# Altium schematic sheet Power.SchDoc: Power
size A3; DocumentNumber: Power; Revision: 2.0; SheetNumber: 6; SheetTotal: 7; Engineer: Dim Su; ContentRev1: Original Document; dateREV1: "Aug/31/2018"; dateREV2: "Sep/03/2018"; ContentRev2: Corrections to PSU IC; Rev1: V1; Rev2: V2; Project: LED_MAT_3
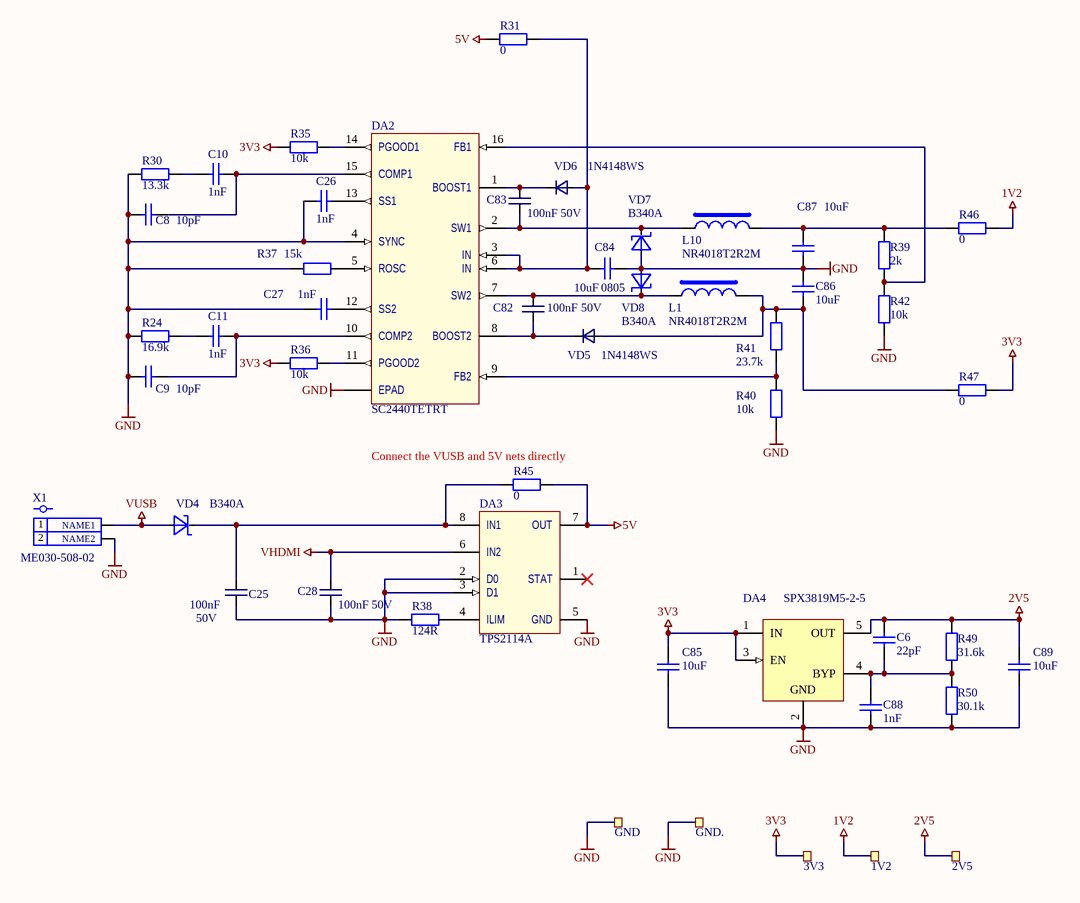
[diagram p0: Power.SchDoc]

## Parts
1V2  TP_TH  [TP_TH_1MM]  (value not drawn)  (no BOM)
2V5  Ø1.0mm,SMD  [TP_SMD_1MM]  (value not drawn)  (no BOM)
3V3  TP_TH  [TP_TH_1MM]  (value not drawn)  (no BOM)
C6  value 22pF  [CAPC1608L]  (hidden comment: 22pF / 0603 / COG / 50V)
C8  value 10pF  [CAPC1608L]  (hidden comment: 10pF / 0603 / COG / 50V)
C9  value 10pF  [CAPC1608L]  (hidden comment: 10pF / 0603 / COG / 50V)
C10  value 1nF  [CAPC1608L]  (hidden comment: 1nF / 0603 / NPO / 50V)
C11  value 1nF  [CAPC1608L]  (hidden comment: 1nF / 0603 / NPO / 50V)
C25  100nF  Voltage: 50V  [CAPC1608L]
C26  value 1nF  [CAPC1608L]  (hidden comment: 1nF / 0603 / NPO / 50V)
C27  value 1nF  [CAPC1608L]  (hidden comment: 1nF / 0603 / NPO / 50V)
C28  100nF  Voltage: 50V  [CAPC1608L]
C82  100nF  Voltage: 50V  [CAPC1608L]
C83  100nF  Voltage: 50V  [CAPC1608L]
C84  value 10uF  Package: 0805  [CAPC2012L]  (hidden comment: 10uF / 0805 /  X5R / 10V)
C85  value 10uF  [CAPC2012L]  (hidden comment: 10uF / 0805 /  X5R / 10V)
C86  value 10uF  [CAPC2012L]  (hidden comment: 10uF / 0805 /  X5R / 10V)
C87  value 10uF  [CAPC2012L]  (hidden comment: 10uF / 0805 /  X5R / 10V)
C88  value 1nF  [CAPC1608L]  (hidden comment: 1nF / 0603 / NPO / 50V)
C89  value 10uF  [CAPC2012L]  (hidden comment: 10uF / 0805 /  X5R / 10V)
DA2  SC2440TETRT  [TSOP65P640X110_HS320X320-16L]
DA3  TPS2114A  [TSSOP65P640X120-8L]
DA4  SPX3819M5-2-5  [TI-DBV6_N]
GND  TP_TH  [TP_TH_1MM]  (value not drawn)  (no BOM)
GND.  TP_TH  [TP_TH_1MM]  (value not drawn)  (no BOM)
L1  NR4018T2R2M  [IND_CD43]
L10  NR4018T2R2M  [IND_CD43]
R24  value 16.9k  [RESC1608L]  (hidden comment: 16.9k / 1% / 0603)
R30  value 13.3k  [RESC1608L]  (hidden comment: 13.3k / 1% / 0603)
R31  value 0  [RESC3216L]  (hidden comment: 0 / 1% / 0603)
R35  value 10k  [RESC1608L]  (hidden comment: 10k / 1% / 0603 / TC100 / 50V / 0.1W)
R36  value 10k  [RESC1608L]  (hidden comment: 10k / 1% / 0603 / TC100 / 50V / 0.1W)
R37  value 15k  [RESC1608L]  (hidden comment: 15k / 1% / 0603)
R38  value 124R  [RESC1608L]  (hidden comment: 124R / 1% / 0603)
R39  value 2k  [RESC1608L]  (hidden comment: 2k / 1% / 0603)
R40  value 10k  [RESC1608L]  (hidden comment: 10k / 1% / 0603 / TC100 / 50V / 0.1W)
R41  value 23.7k  [RESC1608L]  (hidden comment: 23.7k / 1% / 0603)
R42  value 10k  [RESC1608L]  (hidden comment: 10k / 1% / 0603 / TC100 / 50V / 0.1W)
R45  value 0  [RESC1608L]  (hidden comment: 0 / 1% / 0603)
R46  value 0  [RESC1608L]  (hidden comment: 0 / 1% / 0603)
R47  value 0  [RESC1608L]  (hidden comment: 0 / 1% / 0603)
R49  value 31.6k  [RESC1608L]  (hidden comment: 31.6k / 1% / 0603)
R50  value 30.1k  [RESC1608L]  (hidden comment: 30.1k / 1% / 0603)
VD4  B340A  [DO-214AC(SMA)]
VD5  1N4148WS  [SOD123]
VD6  1N4148WS  [SOD123]
VD7  B340A  [DO-214AC(SMA)]
VD8  B340A  [DO-214AC(SMA)]
X1  ME030-508-02  [ME030-508-02]

## Nets
1V2: 1V2.1 R46.2
2V5: 2V5.1 C6.1 C89.2 DA4.5(OUT) R49.2
3V3: 3V3.1 C85.2 DA4.1(IN) DA4.3(EN) R35.1 R36.1 R47.2
5V: DA3.7(OUT) R31.1 R45.2
GND: C8.2 C9.2 C25.2 C26.1 C27.1 C28.1 C84.1 C85.1 C86.1 C87.1 C88.1 C89.1 DA2.4(SYNC) DA2.EPAD DA3.2(D0) DA3.3(D1) DA3.5(GND) DA4.2(GND) GND.1 GND..1 R24.1 R30.1 R37.1 R38.2 R40.2 R42.2 R50.1 VD7.1 VD8.1 X1.2(NAME2)
VHDMI: C28.2 DA3.6(IN2)
VUSB: VD4.1 X1.1(NAME1)
NetC6_2: C6.2 C88.2 DA4.4(BYP) R49.1 R50.2
NetC8_1: C8.1 C10.1 DA2.15(COMP1)
NetC9_1: C9.1 C11.1 DA2.10(COMP2)
NetC10_2: C10.2 R30.2
NetC11_2: C11.2 R24.2
NetC25_1: C25.1 DA3.8(IN1) R45.1 VD4.2
NetC26_2: C26.2 DA2.13(SS1)
NetC27_2: C27.2 DA2.12(SS2)
NetC82_1: C82.1 DA2.8(BOOST2) VD5.2
NetC82_2: C82.2 DA2.7(SW2) L1.1 VD8.2
NetC83_1: C83.1 DA2.2(SW1) L10.1 VD7.2
NetC83_2: C83.2 DA2.1(BOOST1) VD6.2
NetC84_2: C84.2 DA2.3(IN) DA2.6(IN) R31.2 VD6.1
NetC86_2: C86.2 L1.2 R41.1 R47.1 VD5.1
NetC87_2: C87.2 L10.2 R39.1 R46.1
NetDA2_5: DA2.5(ROSC) R37.2
NetDA2_9: DA2.9(FB2) R40.1 R41.2
NetDA2_11: DA2.11(PGOOD2) R36.2
NetDA2_14: DA2.14(PGOOD1) R35.2
NetDA2_16: DA2.16(FB1) R39.2 R42.1
NetDA3_4: DA3.4(ILIM) R38.1

Not connected (* = marked no-connect by the designer): DA3 1(STAT)*

## Notes on the sheet
- (near R45) Connect the VUSB and 5V nets directly
- Title
- Size:
- Date:
- A3
- Number:
- Time:
- Revision:
- Sheet
- of
- File:

## Library data of the parts
1V2 3V3 GND GND. = TESTPAD_TH: Testpoint, through hole; Manufacturer: *; Manufacturer Part Number: *; Value: TP_TH; Supplier: *; Category: Pattern
2V5 = TESTPAD_SMD: circular SMD testpad 1mm; Manufacturer Part Number: *; Value: Ø1.0mm,SMD; Supplier: *; Category: Pattern
C6 C8 C9 = 10pF / 0603 / COG / 50V: Capacitor ceramic; Manufacturer: SAMSUNG; Manufacturer Part Number: CL10C100JB8NNNC; Tolerance: 5%; Package: 0603; Voltage: 50V; CompName: Capacitor; Category: Capacitor; Price: 0.2; Type: COG
C10 C11 C26 C27 C88 = 1nF / 0603 / NPO / 50V: Capacitor ceramic; Manufacturer: MURATA; Manufacturer Part Number: GRM1885C1H102JA01D; Tolerance: 5%; Package: 0603; Voltage: 50V; CompName: Capacitor; Category: Capacitor; Price: 0.2; Type: NPO
C25 C28 C82 C83 = Capacitor CC0805 100nF C0G: Capacitor SMD; Manufacturer: SAMSUNG; Manufacturer Part Number: CL21B104KBCNNNC; Tolerance: 5%; CompName: Capacitor; Value: 100nF; Package: 0805; Price: 0.07
C84-C87 C89 = 10uF / 0805 /  X5R / 10V: Capacitor ceramic; Voltage: 10V; CompName: Capacitor; Price: 0.2
  C85-C87 C89: Package: 0805
DA2 = SC2440: 2.5 MHz Dual Switching Regulator, 2A; CompName: IC; Manufacturer: SEMTECH; CompKind: 0; CompType: SC2440TETRT; ValueBOM: SC2440TETRT; Manufacturer Part Number: SC2440TETRT; Package: TSSOP-16; Price: 43.16
DA3 = TPS2114A: AUTOSWITCHING POWER MUX; CompName: IC; Manufacturer: TI; Manufacturer Part Number: TPS2114A; Price: 1; Value: TPS2114A
DA4 = SPX3819M5-2-5: 500mA, Low-Noise LDO Voltage Regulator; Manufacturer: SIPEX; Tolerance: 1%; Voltage: 2.5V; ComponentLink1Description: Manufacturer URL; ComponentLink1URL: http://www.ti.com/; ComponentLink2Description: Datasheet; ComponentLink2URL: http://www.ti.com/general/docs/lit/getliterature.tsp?genericPartNumber=TPS79301&fileType=pdf; ComponentLink3Description: Package Specification; ComponentLink3URL: http://www.ti.com/litv/pdf/mpds026h; ComponentLink4Description: URL Link1; ComponentLink4URL: Samples URL:http://www.ti.com/product/tps79301#samples; Manufacturer Part Number: SPX3819M5-2-5; Package: SOT23-5; Price: 5.2; Type: IC; Value: SPX3819M5-2-5
L1 L10 = 2.2uH Power Choke: Power choke; CompName: Inductor; Manufacturer: TAIYO YUDE; Value: 2.2uH; Manufacturer Part Number: NR4018T2R2M; Package: 0404; Price: 3.14
R24 = 16.9k / 1% / 0603: Manufacturer: YAGEO; Manufacturer Part Number: RC0603FR0716K9L; CompName: Resistor; Remarks: replaceable; Tolerance: 1%; Package: 0603; Category: Resistor; Price: 0.02; Supplier: ./.; Supplier Order Code: ./.; Temperature: -40...+85°C
R30 = 13.3k / 1% / 0603: Manufacturer: YAGEO; Manufacturer Part Number: RC0603FR-0713K3L; CompName: Resistor; Remarks: replaceable; Tolerance: 1%; Package: 0603; Category: Resistor; Price: 0.03; Supplier: ./.; Supplier Order Code: ./.; Temperature: -40...+85°C
R31 R45-R47 = 2k / 1% / 0603: Manufacturer: YAGEO; Manufacturer Part Number: RC0603FR-070RL; CompName: Resistor; Remarks: replaceable; Tolerance: 1%; Package: 0603; Category: Resistor; Price: 0.02; Supplier: ./.; Supplier Order Code: ./.; Temperature: -40...+85°C
R35 R36 R40 R42 = 10k / 1% / 0603 / TC100 / 50V / 0.1W: Resistor; Tolerance: 1%; Package: 0603; Voltage: 50V; CompName: Resistor; Price: 0.02
R37 = 15k / 1% / 0603: Manufacturer: YAGEO; Manufacturer Part Number: RC0603FR-0715KL; CompName: Resistor; Remarks: replaceable; Tolerance: 1%; Package: 0603; Category: Resistor; Price: 0.03; Supplier: ./.; Supplier Order Code: ./.; Temperature: -40...+85°C
R38 R50 = 124R / 1% / 0603: Manufacturer: PANASONIC; Manufacturer Part Number: ERJ-3EKF1240V; CompName: Resistor; Remarks: replaceable; Tolerance: 1%; Package: 0603; Category: Resistor; Price: 0.02; Supplier: ./.; Supplier Order Code: ./.; Temperature: -40...+85°C
R39 = 2k / 1% / 0603: Manufacturer: YAGEO; Manufacturer Part Number: RC0603FR-072KL; CompName: Resistor; Remarks: replaceable; Tolerance: 1%; Package: 0603; Category: Resistor; Price: 0.02; Supplier: ./.; Supplier Order Code: ./.; Temperature: -40...+85°C
R41 = 23.7k / 1% / 0603: Manufacturer: YAGEO; Manufacturer Part Number: RC0603FR-0723K7L; CompName: Resistor; Remarks: replaceable; Tolerance: 1%; Package: 0603; Category: Resistor; Price: 0.02; Supplier: ./.; Supplier Order Code: ./.; Temperature: -40...+85°C
R49 = 39R / 1% / 0603: Manufacturer: YAGEO; Manufacturer Part Number: RC0603FR-0739RL; CompName: Resistor; Remarks: replaceable; Tolerance: 1%; Package: 0603; Category: Resistor; Price: 0.02; Supplier: ./.; Supplier Order Code: ./.; Temperature: -40...+85°C
VD4 VD7 VD8 = B360A: Shottky restifiers, 2A, SMA Package; CompName: Diode; Manufacturer: DIODES; Voltage: 40V; Manufacturer Part Number: B340A; Package: DO214AC; Value: B340A
  VD4: Price: 1
  VD7 VD8: Price: 1.4; Type: Diode
VD5 VD6 = 1N4148W: Fast switching diode; Manufacturer: VISHAY; Manufacturer Part Number: 1N4148WS-E3-08; CompName: Diode; Package: SOD323; Price: 0.35; Value: 1N4148WS
X1 = CON2_TermBlock: 2-pin HPWR connector; Manufacturer: DECA SWITC; CompName: Connector; Manufacturer Part Number: ME030-508-02; Price: 3.21; Value: ME030-508-02